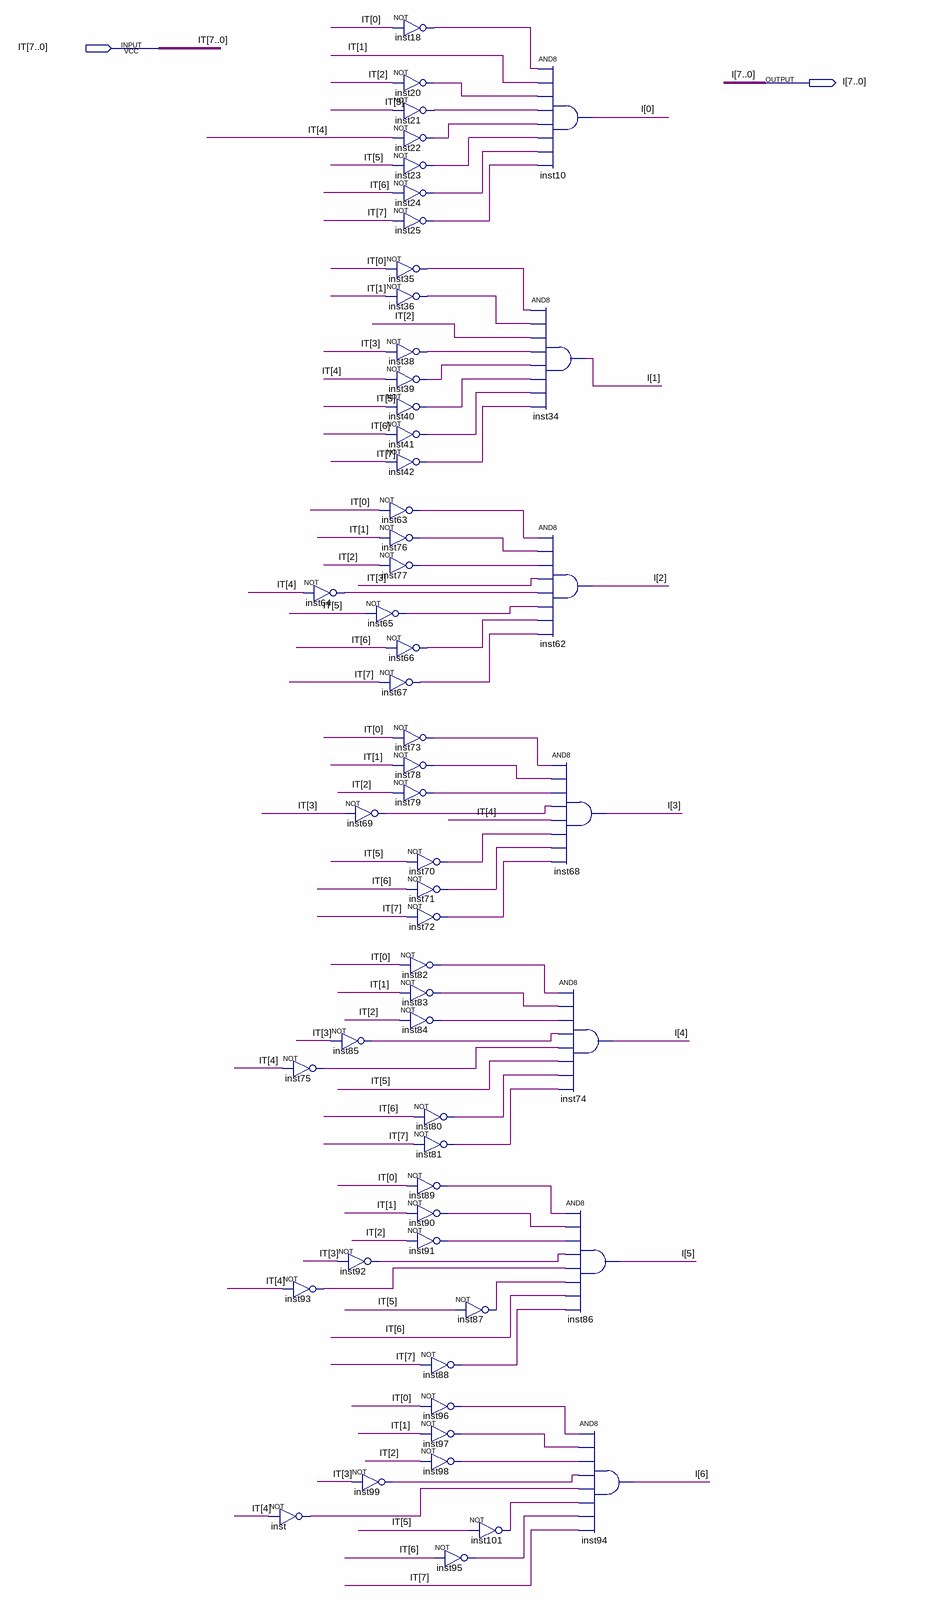
[diagram p0: schematic sheet]
// Quartus schematic MU.bdf as structural Verilog: 56 symbols, 2 pins
module MU (
  input  [7:0] IT,
  output [7:0] I
);

  wire inst18_out, inst20_out, inst21_out, inst22_out, inst23_out, inst24_out, inst25_out, inst35_out,
       inst36_out, inst38_out, inst39_out, inst40_out, inst41_out, inst42_out, inst63_out, inst64_out,
       inst65_out, inst66_out, inst67_out, inst69_out, inst70_out, inst71_out, inst72_out, inst73_out,
       inst75_out, inst76_out, inst77_out, inst78_out, inst79_out, inst80_out, inst81_out, inst82_out,
       inst83_out, inst84_out, inst85_out, inst87_out, inst88_out, inst89_out, inst90_out, inst91_out,
       inst92_out, inst93_out, inst95_out, inst96_out, inst97_out, inst98_out, inst99_out, inst101_out,
       inst_out;

  not inst (inst_out, IT[4]);
  not inst64 (inst64_out, IT[4]);
  not inst85 (inst85_out, IT[3]);
  not inst75 (inst75_out, IT[4]);
  not inst93 (inst93_out, IT[4]);
  not inst35 (inst35_out, IT[0]);
  not inst36 (inst36_out, IT[1]);
  not inst38 (inst38_out, IT[3]);
  not inst39 (inst39_out, IT[4]);
  not inst40 (inst40_out, IT[5]);
  not inst41 (inst41_out, IT[6]);
  not inst42 (inst42_out, IT[7]);
  not inst63 (inst63_out, IT[0]);
  not inst76 (inst76_out, IT[1]);
  not inst77 (inst77_out, IT[2]);
  not inst65 (inst65_out, IT[5]);
  not inst66 (inst66_out, IT[6]);
  not inst67 (inst67_out, IT[7]);
  not inst69 (inst69_out, IT[3]);
  not inst92 (inst92_out, IT[3]);
  not inst99 (inst99_out, IT[3]);
  not inst18 (inst18_out, IT[0]);
  not inst20 (inst20_out, IT[2]);
  not inst21 (inst21_out, IT[3]);
  not inst22 (inst22_out, IT[4]);
  not inst23 (inst23_out, IT[5]);
  not inst24 (inst24_out, IT[6]);
  not inst25 (inst25_out, IT[7]);
  not inst73 (inst73_out, IT[0]);
  not inst78 (inst78_out, IT[1]);
  not inst79 (inst79_out, IT[2]);
  not inst70 (inst70_out, IT[5]);
  not inst71 (inst71_out, IT[6]);
  not inst72 (inst72_out, IT[7]);
  not inst82 (inst82_out, IT[0]);
  not inst83 (inst83_out, IT[1]);
  not inst84 (inst84_out, IT[2]);
  not inst80 (inst80_out, IT[6]);
  not inst81 (inst81_out, IT[7]);
  not inst89 (inst89_out, IT[0]);
  not inst90 (inst90_out, IT[1]);
  not inst91 (inst91_out, IT[2]);
  not inst88 (inst88_out, IT[7]);
  not inst96 (inst96_out, IT[0]);
  not inst97 (inst97_out, IT[1]);
  not inst98 (inst98_out, IT[2]);
  not inst95 (inst95_out, IT[6]);
  not inst87 (inst87_out, IT[5]);
  not inst101 (inst101_out, IT[5]);
  and inst10 (I[0], inst18_out, IT[1], inst20_out, inst21_out, inst22_out, inst23_out, inst24_out, inst25_out);
  and inst34 (I[1], inst35_out, inst36_out, IT[2], inst38_out, inst39_out, inst40_out, inst41_out, inst42_out);
  and inst62 (I[2], inst63_out, inst76_out, inst77_out, IT[3], inst64_out, inst65_out, inst66_out, inst67_out);
  and inst68 (I[3], inst73_out, inst78_out, inst79_out, inst69_out, IT[4], inst70_out, inst71_out, inst72_out);
  and inst74 (I[4], inst82_out, inst83_out, inst84_out, inst85_out, inst75_out, IT[5], inst80_out, inst81_out);
  and inst86 (I[5], inst89_out, inst90_out, inst91_out, inst92_out, inst93_out, inst87_out, IT[6], inst88_out);
  and inst94 (I[6], inst96_out, inst97_out, inst98_out, inst99_out, inst_out, inst101_out, inst95_out, IT[7]);
endmodule
